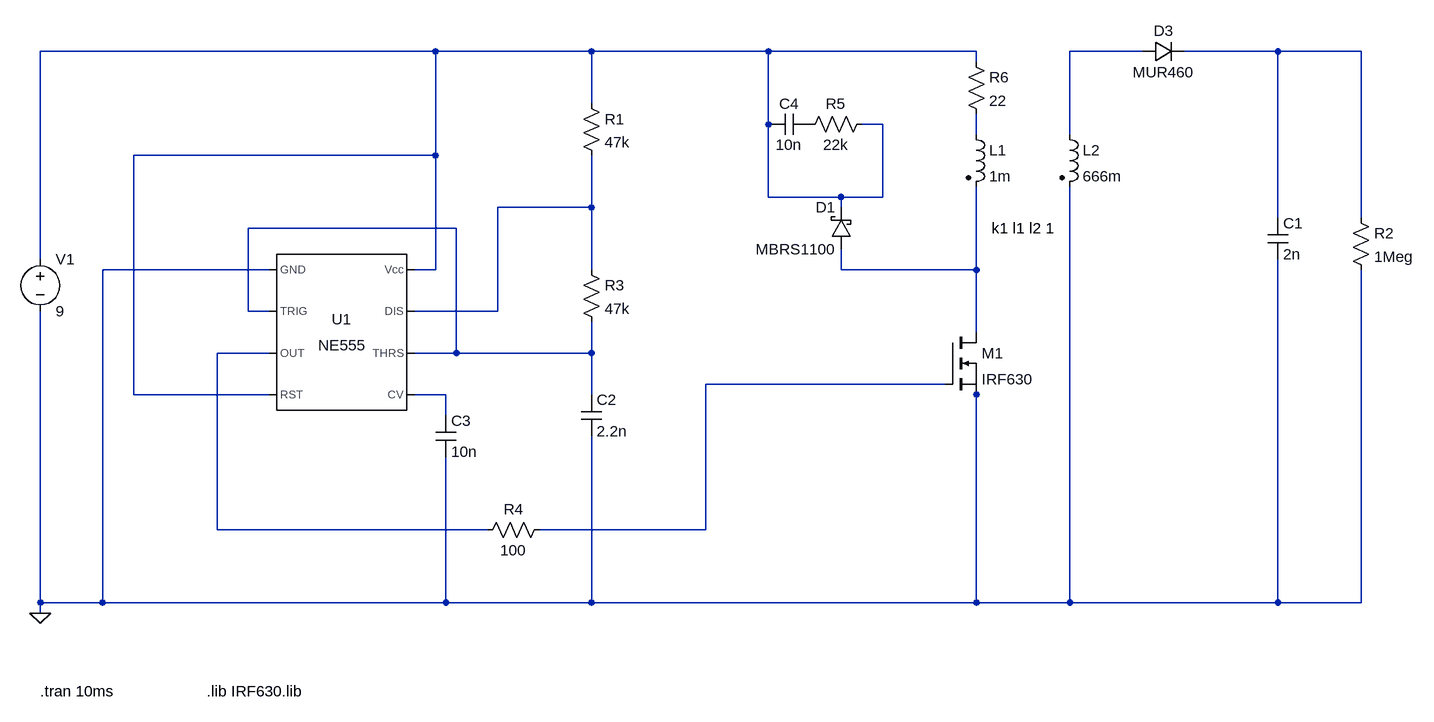
[diagram p0: schematic Geiger_No_Voltage_Doubler.asc]
Geiger_No_Voltage_Doubler.asc, the LTspice schematic file:
Version 4
SHEET 1 2052 808
WIRE 320 -192 -288 -192
WIRE 560 -192 320 -192
WIRE 832 -192 560 -192
WIRE 1152 -192 832 -192
WIRE 1408 -192 1296 -192
WIRE 1616 -192 1472 -192
WIRE 1744 -192 1616 -192
WIRE 1152 -176 1152 -192
WIRE 560 -112 560 -192
WIRE 832 -80 832 -192
WIRE 1008 -80 976 -80
WIRE 1152 -64 1152 -96
WIRE 1296 -64 1296 -192
WIRE 320 -32 320 -192
WIRE 320 -32 -144 -32
WIRE 832 32 832 -80
WIRE 944 32 832 32
WIRE 1008 32 1008 -80
WIRE 1008 32 944 32
WIRE 560 48 560 -32
WIRE 560 48 416 48
WIRE 944 48 944 32
WIRE 1616 64 1616 -192
WIRE 1744 64 1744 -192
WIRE 352 80 32 80
WIRE -288 128 -288 -192
WIRE 64 144 -192 144
WIRE 320 144 320 -32
WIRE 320 144 288 144
WIRE 560 144 560 48
WIRE 944 144 944 112
WIRE 1152 144 1152 16
WIRE 1152 144 944 144
WIRE 32 208 32 80
WIRE 64 208 32 208
WIRE 416 208 416 48
WIRE 416 208 288 208
WIRE 1152 240 1152 144
WIRE 64 272 -16 272
WIRE 352 272 352 80
WIRE 352 272 288 272
WIRE 560 272 560 224
WIRE 560 272 352 272
WIRE 1104 320 736 320
WIRE -144 336 -144 -32
WIRE 64 336 -144 336
WIRE 336 336 288 336
WIRE 560 336 560 272
WIRE 1152 336 1152 288
WIRE 336 368 336 336
WIRE -16 544 -16 272
WIRE 400 544 -16 544
WIRE 736 544 736 320
WIRE 736 544 480 544
WIRE -288 656 -288 208
WIRE -192 656 -192 144
WIRE -192 656 -288 656
WIRE 336 656 336 432
WIRE 336 656 -192 656
WIRE 560 656 560 400
WIRE 560 656 336 656
WIRE 1152 656 1152 336
WIRE 1152 656 560 656
WIRE 1296 656 1296 16
WIRE 1296 656 1152 656
WIRE 1616 656 1616 128
WIRE 1616 656 1296 656
WIRE 1744 656 1744 144
WIRE 1744 656 1616 656
WIRE -288 672 -288 656
FLAG -288 672 0
SYMBOL Misc\\NE555 176 240 R0
SYMATTR InstName U1
SYMBOL voltage -288 112 R0
WINDOW 123 0 0 Left 0
WINDOW 39 0 0 Left 0
SYMATTR InstName V1
SYMATTR Value 9
SYMBOL nmos 1104 240 R0
SYMATTR InstName M1
SYMATTR Value IRF630
SYMBOL ind2 1136 -80 R0
SYMATTR InstName L1
SYMATTR Value 1m
SYMATTR Type ind
SYMATTR SpiceLine Ipk=0.4 Rser=1m Rpar=0
SYMBOL ind2 1280 -80 R0
SYMATTR InstName L2
SYMATTR Value 666m
SYMATTR Type ind
SYMATTR SpiceLine Rser=1m Rpar=0
SYMBOL diode 1408 -176 R270
WINDOW 0 32 32 VTop 2
WINDOW 3 0 32 VBottom 2
SYMATTR InstName D3
SYMATTR Value MUR460
SYMBOL res 1728 48 R0
SYMATTR InstName R2
SYMATTR Value 1Meg
SYMBOL cap 1600 64 R0
SYMATTR InstName C1
SYMATTR Value 2n
SYMBOL res 544 -128 R0
SYMATTR InstName R1
SYMATTR Value 47k
SYMBOL res 544 128 R0
SYMATTR InstName R3
SYMATTR Value 47k
SYMBOL cap 544 336 R0
SYMATTR InstName C2
SYMATTR Value 2.2n
SYMBOL cap 320 368 R0
SYMATTR InstName C3
SYMATTR Value 10n
SYMBOL res 496 528 R90
WINDOW 0 0 56 VBottom 2
WINDOW 3 32 56 VTop 2
SYMATTR InstName R4
SYMATTR Value 100
SYMBOL res 1136 -192 R0
SYMATTR InstName R6
SYMATTR Value 22
SYMBOL cap 832 -64 R270
WINDOW 0 32 32 VTop 2
WINDOW 3 0 32 VBottom 2
SYMATTR InstName C4
SYMATTR Value 10n
SYMBOL schottky 960 112 R180
WINDOW 0 24 64 Left 2
WINDOW 3 24 0 Left 2
SYMATTR InstName D1
SYMATTR Value MBRS1100
SYMATTR Description Diode
SYMATTR Type diode
SYMBOL res 992 -96 R90
WINDOW 0 0 56 VBottom 2
WINDOW 3 32 56 VTop 2
SYMATTR InstName R5
SYMATTR Value 22k
TEXT 1176 80 Left 2 !k1 l1 l2 1
TEXT -288 792 Left 2 !.tran 10ms
TEXT -32 792 Left 2 !.lib IRF630.lib

The netlist it stands for:
* Geiger_No_Voltage_Doubler.asc
XU1 0 N006 N008 N001 N010 N006 N005 N001 NE555  ; pins GND TRIG OUT RST CV THRS DIS Vcc
V1 N001 0 9
M1 N007 N009 0 0 IRF630
L1 N004 N007 1m Ipk=0.4 Rser=1m Rpar=0
L2 N002 0 666m Rser=1m Rpar=0
D3 N002 N003 MUR460
R2 N003 0 1Meg
C1 N003 0 2n
R1 N001 N005 47k
R3 N005 N006 47k
C2 N006 0 2.2n
C3 N010 0 10n
R4 N009 N008 100
R6 N001 N004 22
C4 N001 P001 10n
D1 N007 N001 MBRS1100
R5 N001 P001 22k
.model D D
.lib standard.dio
.model NMOS NMOS
.model PMOS PMOS
.lib standard.mos
k1 l1 l2 1
.tran 10ms
.lib IRF630.lib
.lib NE555.sub
.backanno
.end